# Altium schematic sheet MCU1.SchDoc: LiveDesign Evaluation - Morse Code
size A; Organization: Altium Limited; Address1: L3, 12a Rodborough Rd; Address2: Frenchs Forest; Address3: NSW; Address4: Australia 2086; DocumentNumber: 2; SheetNumber: 2; SheetTotal: 2
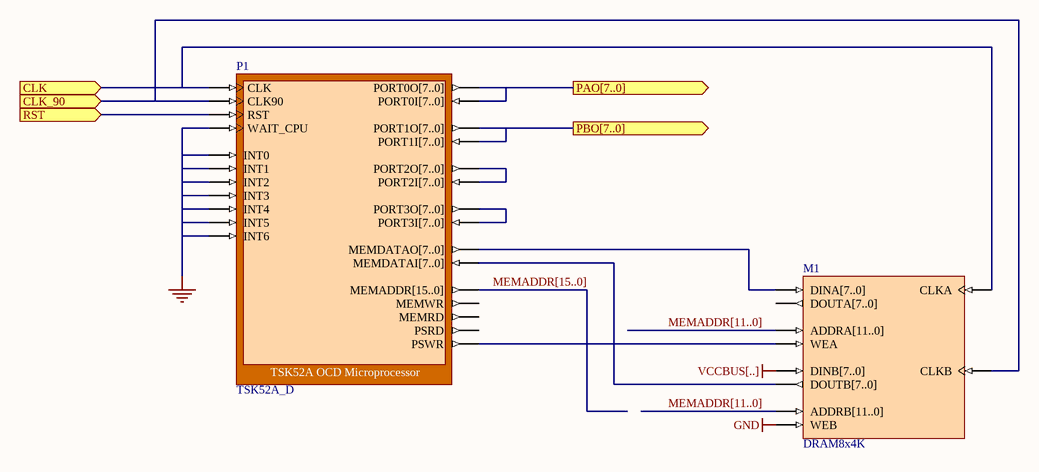
[diagram p0: MCU1.SchDoc]

## Parts
M1  DRAM8x4K
P1  TSK52A_D

## Ports
CLK (in), CLK_90 (in), PAO[7..0] (out), PBO[7..0] (out), RST (in)

## Nets
GND: M1.WEB P1.INT0 P1.INT1 P1.INT2 P1.INT3 P1.INT4 P1.INT5 P1.INT6 P1.WAIT_CPU
VCCBUS[..]: M1.DINB[7..0]
CLK: M1.CLKA P1.CLK ; port CLK
CLK_90: M1.CLKB P1.CLK90 ; port CLK_90
MEMADDR[11..0]: M1.ADDRA[11..0] M1.ADDRB[11..0]
MEMADDR[15..0]: P1.MEMADDR[15..0]
PAO[7..0]: P1.PORT0I[7..0] P1.PORT0O[7..0] ; port PAO[7..0]
PBO[7..0]: P1.PORT1I[7..0] P1.PORT1O[7..0] ; port PBO[7..0]
RST: P1.RST ; port RST
NetM1_DINA[7..0]: M1.DINA[7..0] P1.MEMDATAO[7..0]
NetM1_DOUTB[7..0]: M1.DOUTB[7..0] P1.MEMDATAI[7..0]
NetM1_WEA: M1.WEA P1.PSWR
NetP1_PORT2I[7..0]: P1.PORT2I[7..0] P1.PORT2O[7..0]
NetP1_PORT3I[7..0]: P1.PORT3I[7..0] P1.PORT3O[7..0]

Not connected (* = marked no-connect by the designer): M1 DOUTA[7..0]; P1 MEMRD MEMWR PSRD

## Buses and harness runs
bus MEMADDR[11..0]
bus MEMADDR[15..0]

## Notes on the sheet
- Title
- Size:
- Date:
- A
- Number:
- Time:
- Revision:
- Sheet
- of
- File:

## Library data of the parts
M1 = DRAM8x4K: Dual Port Random Access Memory 4096 x 8 and 4096 x 8; Memory_DepthA: 4096; Memory_Type: RAM_DualPortBlock; Memory_WidthA: 8; Memory_ClockEdge: Rising; Nexus_Core: Memory_Program; Published: 26/09/2003; Publisher: Altium Hobart Technology Center; Memory_DepthB: 4096; Memory_WidthB: 8
P1 = TSK52A_D: TSK52A OCD Microprocessor; NEXUS_CORE: Processor_OCDS; NEXUS_JTAG_DEVICE: True; NEXUS_JTAG_ORDER: 0; ChildModel1: TSK52A_D_DRAM8X256; ChildCore1: M1; Memory_Configuration: Record[NEXUS_CORE]{}ComponentDesignator[iram]{}Memory_Depth[256]{}Memory_UsageType[ram]{}ProgramDownloadAddress[0x0]{}Memory_BusType[c51:idata_bus]{n}Record[NEXUS_CORE]{}ComponentDesignator[xram]{}Memory_Depth[64k]{}Memory_UsageType[ram]{}ProgramDownloadAddress[0x0]{}Memory_BusType[c51:xdata_bus]{n}Record[NEXUS_CORE]{}ComponentDesignator[xrom]{}Memory_Depth[64k]{}Memory_UsageType[rom]{}ProgramDownloadAddress[0x0]{}Memory_BusType[c51:code_bus]{n}; Published: 1/12/2003; Publisher: Altium Hobart Technology Centre; Core Revision: 1.00.00